# Altium schematic sheet PA2_PMIC.SchDoc
size A3
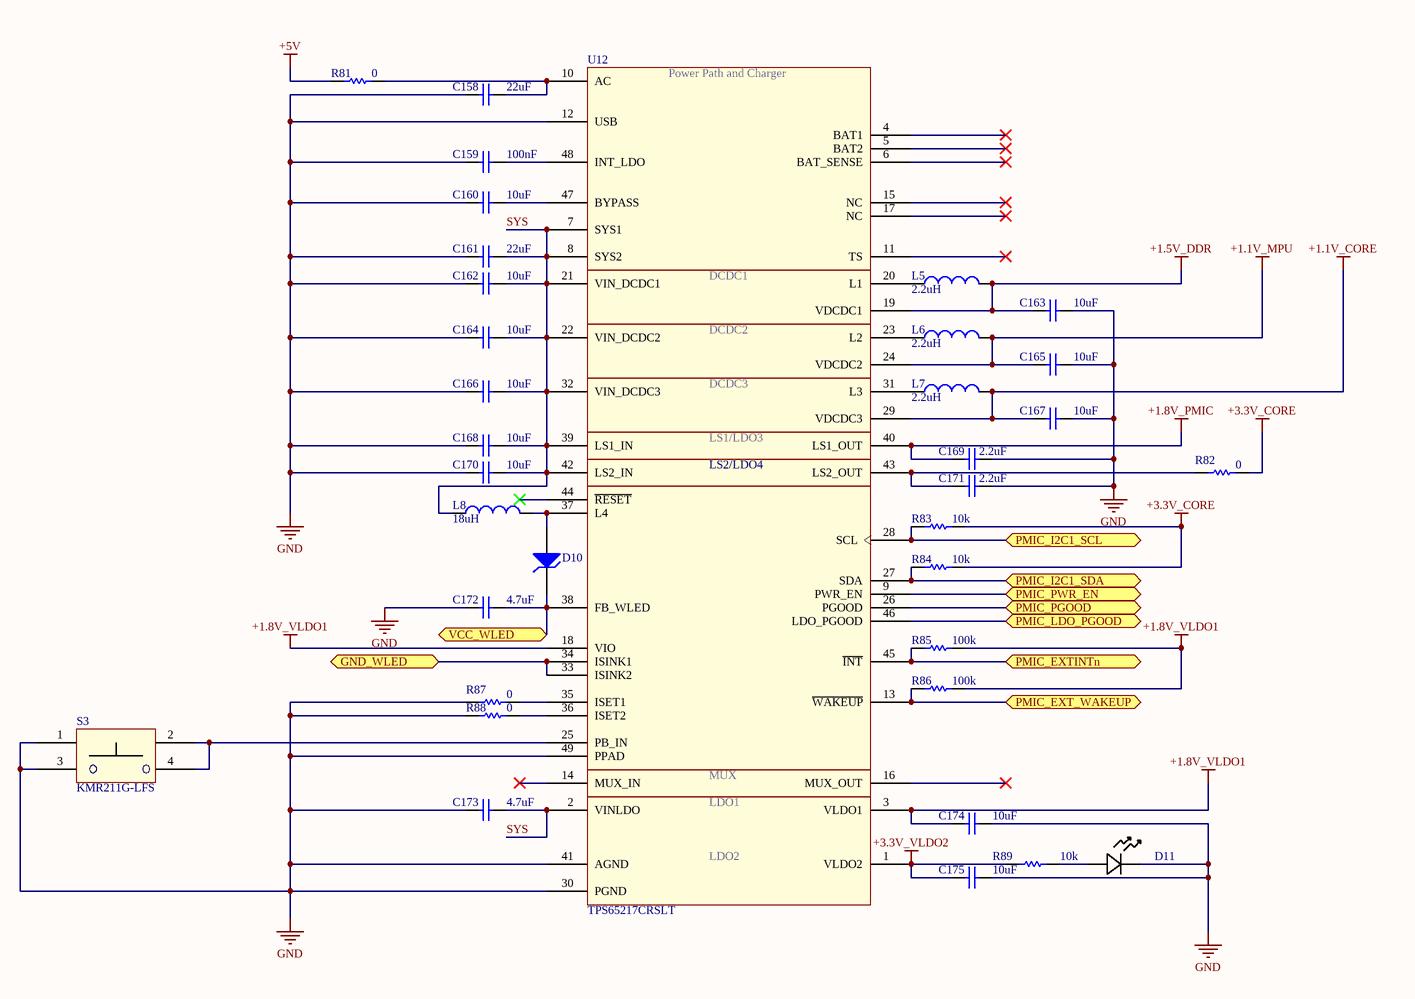
[diagram p0: PA2_PMIC.SchDoc]

## Parts
C158  value 22uF  [CAPC1608X08]  (hidden comment: Cap 22uF)
C159  value 100nF  [CAPC1608X08]  (hidden comment: Cap 100nF)
C160  value 10uF  [CAPC1608X08]  (hidden comment: Cap 10uF)
C161  value 22uF  [CAPC1608X08]  (hidden comment: Cap 22uF)
C162  value 10uF  [CAPC1608X08]  (hidden comment: Cap 10uF)
C163  value 10uF  [CAPC1608X08]  (hidden comment: Cap 10uF)
C164  value 10uF  [CAPC1608X08]  (hidden comment: Cap 10uF)
C165  value 10uF  [CAPC1608X08]  (hidden comment: Cap 10uF)
C166  value 10uF  [CAPC1608X08]  (hidden comment: Cap 10uF)
C167  value 10uF  [CAPC1608X08]  (hidden comment: Cap 10uF)
C168  value 10uF  [CAPC1608X08]  (hidden comment: Cap 10uF)
C169  value 2.2uF  [CAPC1608X08]  (hidden comment: Cap 2.2uF)
C170  value 10uF  [CAPC1608X08]  (hidden comment: Cap 10uF)
C171  value 2.2uF  [CAPC1608X08]  (hidden comment: Cap 2.2uF)
C172  value 4.7uF  [CAPC1608X08]  (hidden comment: Cap 4.7uF)
C173  value 4.7uF  [CAPC1608X08]  (hidden comment: Cap 4.7uF)
C174  value 10uF  [CAPC1608X08]  (hidden comment: Cap 10uF)
C175  value 10uF  [CAPC1608X08]  (hidden comment: Cap 10uF)
D10  D Zener  [MF03A-M]  (value not drawn)
D11  Blanc  [LED_LNJ]  (value not drawn)
L5  value 2.2uH  [INDM1608X08N]  (hidden comment: Inductor)
L6  value 2.2uH  [INDM1608X08N]  (hidden comment: Inductor)
L7  value 2.2uH  [INDM1608X08N]  (hidden comment: Inductor)
L8  value 18uH  [INDM2612X12N]  (hidden comment: Inductor)
R81  value 0  [RESC1608X05]  (hidden comment: Res 0 Ohm)
R82  value 0  [RESC1608X05]  (hidden comment: Res 0 Ohm)
R83  value 10k  [RESC1608X05]  (hidden comment: Res 10k)
R84  value 10k  [RESC1608X05]  (hidden comment: Res 10k)
R85  value 100k  [RESC1608X05]  (hidden comment: Res 100k)
R86  value 100k  [RESC1608X05]  (hidden comment: Res 100k)
R87  value 0  [RESC1608X05]  (hidden comment: Res 0 Ohm)
R88  value 0  [RESC1608X05]  (hidden comment: Res 0 Ohm)
R89  value 10k  [RESC1608X05]  (hidden comment: Res 10k)
S3  KMR211G-LFS  [C&K_KMR211G]
U12  TPS65217CRSLT  [CRSLT]

## Ports
GND_WLED, PMIC_EXT_WAKEUP, PMIC_EXTINTn, PMIC_I2C1_SCL, PMIC_I2C1_SDA, PMIC_LDO_PGOOD, PMIC_PGOOD, PMIC_PWR_EN, VCC_WLED

## Nets
+1.1V_CORE: C167.1 L7.2 U12.29(VDCDC3)
+1.1V_MPU: C165.1 L6.2 U12.24(VDCDC2)
+1.5V_DDR: C163.1 L5.2 U12.19(VDCDC1)
+1.8V_PMIC: C169.2 U12.40(LS1_OUT)
+1.8V_VLDO1: C174.1 R85.2 R86.2 U12.3(VLDO1) U12.18(VIO)
+3.3V_CORE: R82.2 R83.2 R84.2
+3.3V_VLDO2: C175.1 R89.1 U12.1(VLDO2)
+5V: R81.1
GND: C158.1 C159.1 C160.1 C161.1 C162.1 C163.2 C164.1 C165.2 C166.1 C167.2 C168.1 C169.1 C170.1 C171.1 C172.1 C173.1 C174.2 C175.2 D11.1 R87.1 R88.1 S3.1 S3.3 U12.12(USB) U12.30(PGND) U12.41(AGND) U12.49(PPAD)
GND_WLED: U12.33(ISINK2) U12.34(ISINK1) ; port GND_WLED
PMIC_EXT_WAKEUP: R86.1 U12.13(~{WAKEUP}) ; port PMIC_EXT_WAKEUP
PMIC_EXTINTn: R85.1 U12.45(~{INT}) ; port PMIC_EXTINTn
PMIC_I2C1_SCL: R83.1 U12.28(SCL) ; port PMIC_I2C1_SCL
PMIC_I2C1_SDA: R84.1 U12.27(SDA) ; port PMIC_I2C1_SDA
PMIC_LDO_PGOOD: U12.46(LDO_PGOOD) ; port PMIC_LDO_PGOOD
PMIC_PGOOD: U12.26(PGOOD) ; port PMIC_PGOOD
PMIC_PWR_EN: U12.9(PWR_EN) ; port PMIC_PWR_EN
SYS: C161.2 C162.2 C164.2 C166.2 C168.2 C170.2 C173.2 L8.1 U12.2(VINLDO) U12.7(SYS1) U12.8(SYS2) U12.21(VIN_DCDC1) U12.22(VIN_DCDC2) U12.32(VIN_DCDC3) U12.39(LS1_IN) U12.42(LS2_IN)
VCC_WLED: C172.2 D10.2(K) U12.38(FB_WLED) ; port VCC_WLED
NetC158_2: C158.2 R81.2 U12.10(AC)
NetC159_2: C159.2 U12.48(INT_LDO)
NetC160_2: C160.2 U12.47(BYPASS)
NetC171_2: C171.2 R82.1 U12.43(LS2_OUT)
NetD10_1: D10.1(A) L8.2 U12.37(L4)
NetD11_2: D11.2 R89.2
NetL5_1: L5.1 U12.20(L1)
NetL6_1: L6.1 U12.23(L2)
NetL7_1: L7.1 U12.31(L3)
NetR87_2: R87.2 U12.35(ISET1)
NetR88_2: R88.2 U12.36(ISET2)
NetS3_2: S3.2 S3.4 U12.25(PB_IN)

Not connected (* = marked no-connect by the designer): U12 4(BAT1)* 5(BAT2)* 6(BAT_SENSE)* 11(TS)* 14(MUX_IN)* 15(NC)* 16(MUX_OUT)* 17(NC)* 44(~{RESET})*

## Notes on the sheet
- (in symbol TPS65217CRSLT) Power Path and Charger; DCDC1; DCDC2; DCDC3; LS1/LDO3; LS2/LDO4; MUX; LDO1; LDO2

## Library data of the parts
C158 C161 = Cap: Capacitor; Fabricant: MURATA; Fournisseur: Farnell; RefFabricant: GRM188R61A226ME15D; RefFournisseur: 2426957; Case: 0603 [1608 Metric]; DataSheet: http://www.farnell.com/datasheets/2047978.pdf
C159 = Cap: Capacitor; RefFournisseur: 2522432; RefFabricant: C0603T104K5RALTU; Fabricant: KEMET; Fournisseur: Farnell; Case: 0603 [1608 Metric]
C160 C162-C168 C170 C174 C175 = Cap: Capacitor; Fournisseur: Farnell; RefFournisseur: 2309028; RefFabricant: C1608X5R1A106M080AC; Fabricant: TDK; Case: 0603 [1608 Metric]; DataSheet: http://www.farnell.com/datasheets/2291921.pdf
C169 C171 = Cap: Capacitor; RefFabricant: GRT188R60J225KE13D; Fabricant: MURATA; Fournisseur: Farnell; RefFournisseur: 2672153; Case: 0603 [1608 Metric]; DataSheet: http://www.farnell.com/datasheets/2165952.pdf
C172 C173 = Cap: Capacitor; Fabricant: MURATA; Fournisseur: Farnell; RefFabricant: GRT188R61E475KE13D; RefFournisseur: 2672159; DataSheet: http://www.farnell.com/datasheets/2165958.pdf; Case: 0603 [1608 Metric]
D10 = D Zener: Zener Diode; RefFabricant: LM4041DIM3-1.2; RefFournisseur: 9778349; Fabricant: TEXAS INSTRUMENTS; Fournisseur: Farnell; DataSheet: http://www.ti.com/lit/ds/symlink/lm4041-n.pdf
D11 = LNJ037X8ARA: LED Blanc; RefFournisseur: 1908051; Fabricant: PANASONIC ELECTRONIC COMPONENTS; Fournisseur: Farnell; RefFabricant: LNJ037X8ARA; DataSheet: http://www.farnell.com/datasheets/2085723.pdf
L5-L7 = Inductor: Fabricant: MURATA; Fournisseur: Farnell; RefFabricant: LQM18NN2R2K00D; RefFournisseur: 1343118; Case: 0603 [1608 Metric]; DataSheet: http://www.farnell.com/datasheets/66032.pdf
L8 = Inductor: Fabricant: TDK; Fournisseur: Farnell; RefFabricant: MLF2012C180K; RefFournisseur: 1669551; Case: 0805 [2012 Metric]; DataSheet: http://www.farnell.com/datasheets/321059.pdf
R81 R82 R87 R88 = Res1: Resistor; Fabricant: VISHAY; Fournisseur: Farnell; RefFabricant: CRCW06030000Z0EB; RefFournisseur: 2616741; Case: 0603 [1608 Metric]
R83 R84 R89 = Res1: Resistor; Fabricant: TE CONNECTIVITY; Fournisseur: Farnell; RefFabricant: CRGH0603J10K; RefFournisseur: 2331740; Case: 0603 [1608 Metric]; DataSheet: CRGH0603J10K
R85 R86 = Res1: Resistor; Fabricant: TE CONNECTIVITY; Fournisseur: Farnell; RefFabricant: RN73C1J100KBTDF; RefFournisseur: 2687850; Case: 0603 [1608 Metric]; DataSheet: http://www.farnell.com/datasheets/2189072.pdf
S3 = KMR211G-LFS: Commutateur tactile; Fournisseur: Farnell; RefFournisseur: 1437635; RefFabricant: KMR211G LFS; Fabricant: C & K COMPONENTS; DataSheet: http://www.farnell.com/datasheets/2044619.pdf
U12 = TPS65217CRSLT: Gestion d'alimentation PMIC; Fabricant: TEXAS INSTRUMENTS; Fournisseur: Farnell; RefFournisseur: 2492485; RefFabricant: TPS65217CRSLT; DataSheet: http://www.ti.com/lit/ds/symlink/tps65217.pdf